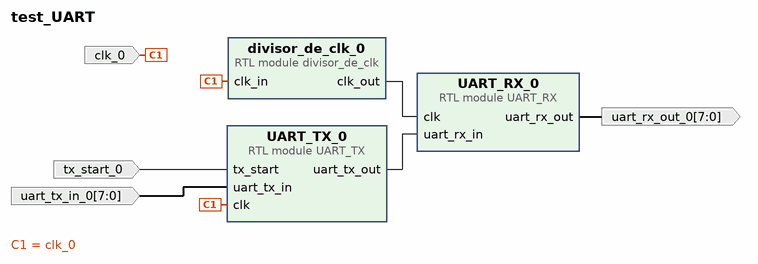
[diagram p0: block diagram of the top level]
# Vivado block design test_UART, xc7a35tcpg236-1, Vivado 2020.1
create_bd_design test_UART

create_bd_port -dir I -type clk clk_0
create_bd_port -dir I tx_start_0
create_bd_port -dir O -from 7 -to 0 uart_rx_out_0
create_bd_port -dir I -from 7 -to 0 uart_tx_in_0

create_bd_cell -type module -reference divisor_de_clk divisor_de_clk_0
create_bd_cell -type module -reference UART_RX UART_RX_0
create_bd_cell -type module -reference UART_TX UART_TX_0

# ---- connections ----

connect_bd_net [get_bd_pins divisor_de_clk_0/clk_out] [get_bd_pins UART_RX_0/clk]
connect_bd_net -net clk_0_1 [get_bd_ports clk_0] [get_bd_pins divisor_de_clk_0/clk_in] [get_bd_pins UART_TX_0/clk]
connect_bd_net [get_bd_pins UART_RX_0/uart_rx_out] [get_bd_ports uart_rx_out_0]
connect_bd_net [get_bd_pins UART_TX_0/uart_tx_out] [get_bd_pins UART_RX_0/uart_rx_in]
connect_bd_net -net tx_start_0_1 [get_bd_ports tx_start_0] [get_bd_pins UART_TX_0/tx_start]
connect_bd_net -net uart_tx_in_0_1 [get_bd_ports uart_tx_in_0] [get_bd_pins UART_TX_0/uart_tx_in]

validate_bd_design
save_bd_design
